# EAGLE design schem (EAGLE 8.7.1)
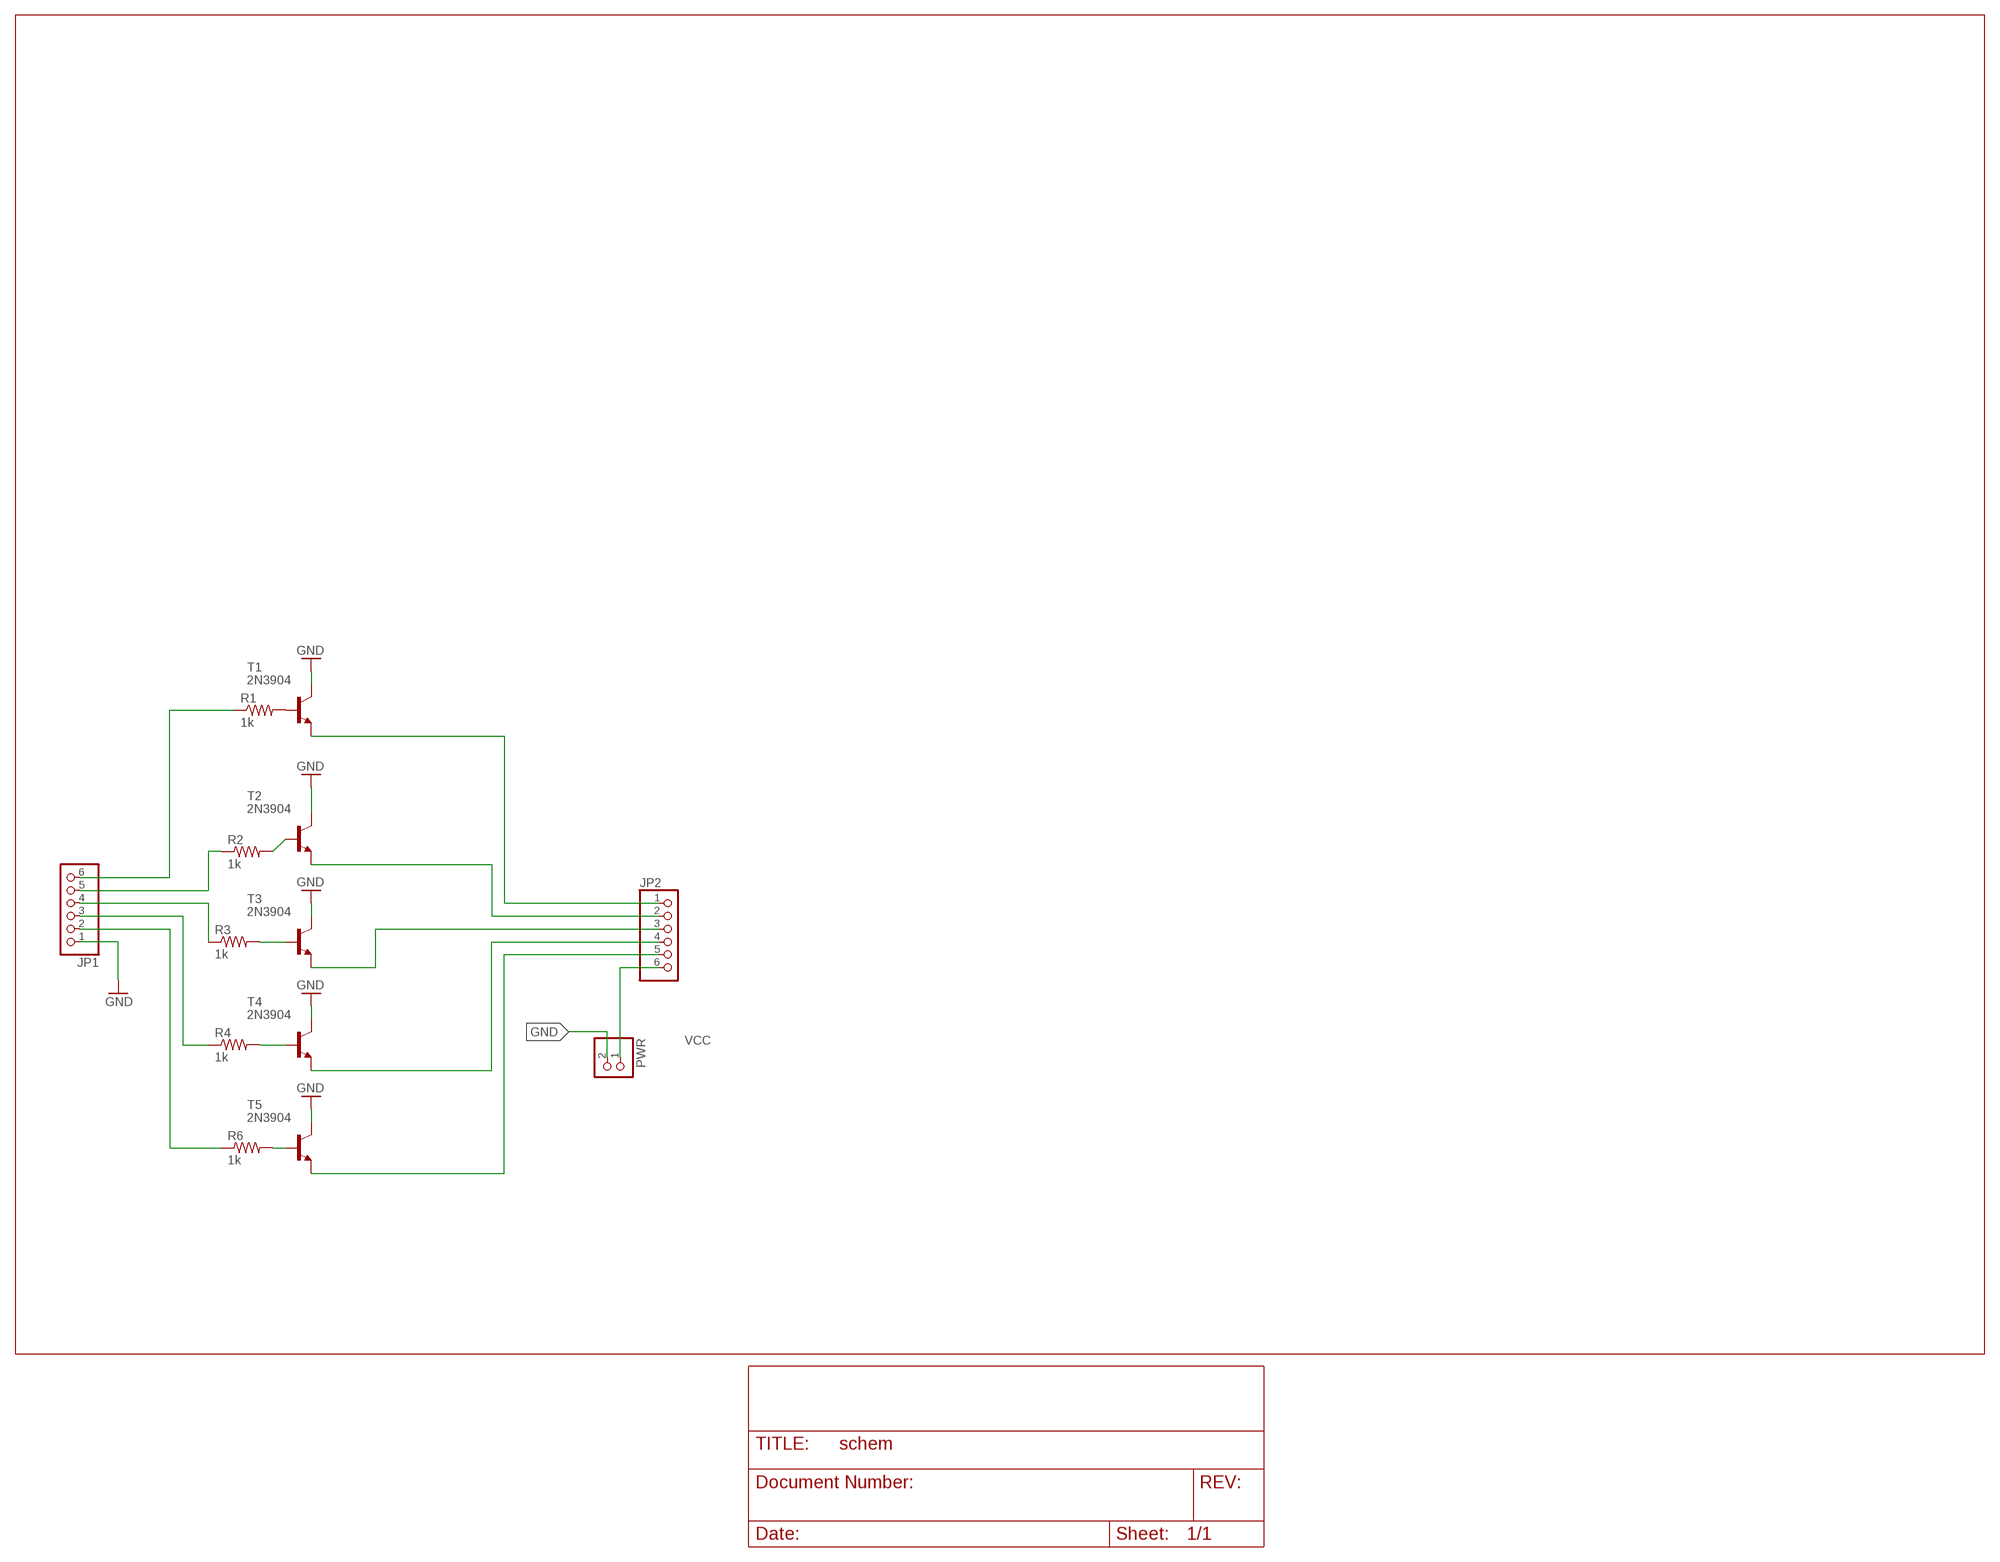
[diagram p0: schematic, sheet 1]

## Parts
JP1  PINHD-1X6  [1X06]
JP2  PINHD-1X6  [1X06]
PWR  PINHD-1X2  [1X02]
R1  1k  R-US_0207/5V  [0207/5V]
R2  1k  R-US_0207/5V  [0207/5V]
R3  1k  R-US_0207/5V  [0207/5V]
R4  1k  R-US_0207/5V  [0207/5V]
R6  1k  R-US_0207/5V  [0207/5V]
T1  2N3904  [TO92]
T2  2N3904  [TO92]
T3  2N3904  [TO92]
T4  2N3904  [TO92]
T5  2N3904  [TO92]

## Nets
GND: JP1.1 PWR.2 T1.1(C) T2.1(C) T3.1(C) T4.1(C) T5.1(C)
N$1: JP1.6 R1.1
N$2: R1.2 T1.2(B)
N$3: JP1.2 R6.1
N$4: R3.2 T3.2(B)
N$5: JP1.5 R2.1
N$6: R2.2 T2.2(B)
N$7: JP2.1 T1.3(E)
N$8: JP1.4 R3.1
N$9: JP1.3 R4.1
N$10: R4.2 T4.2(B)
N$11: JP2.2 T2.3(E)
N$12: R6.2 T5.2(B)
N$13: JP2.3 T3.3(E)
N$14: JP2.4 T4.3(E)
N$15: JP2.5 T5.3(E)
VCC: JP2.6 PWR.1

## Library data of the parts
JP1 = pinhead:PINHD-1X6: PIN HEADER
JP2 = pinhead:PINHD-1X6: PIN HEADER; SPICEPREFIX: X
PWR = pinhead:PINHD-1X2: PIN HEADER
R1-R4 R6 = resistor:R-US_: RESISTOR, American symbol
T1-T5 = transistor:2N3904: NPN TRANSISTOR

## Board
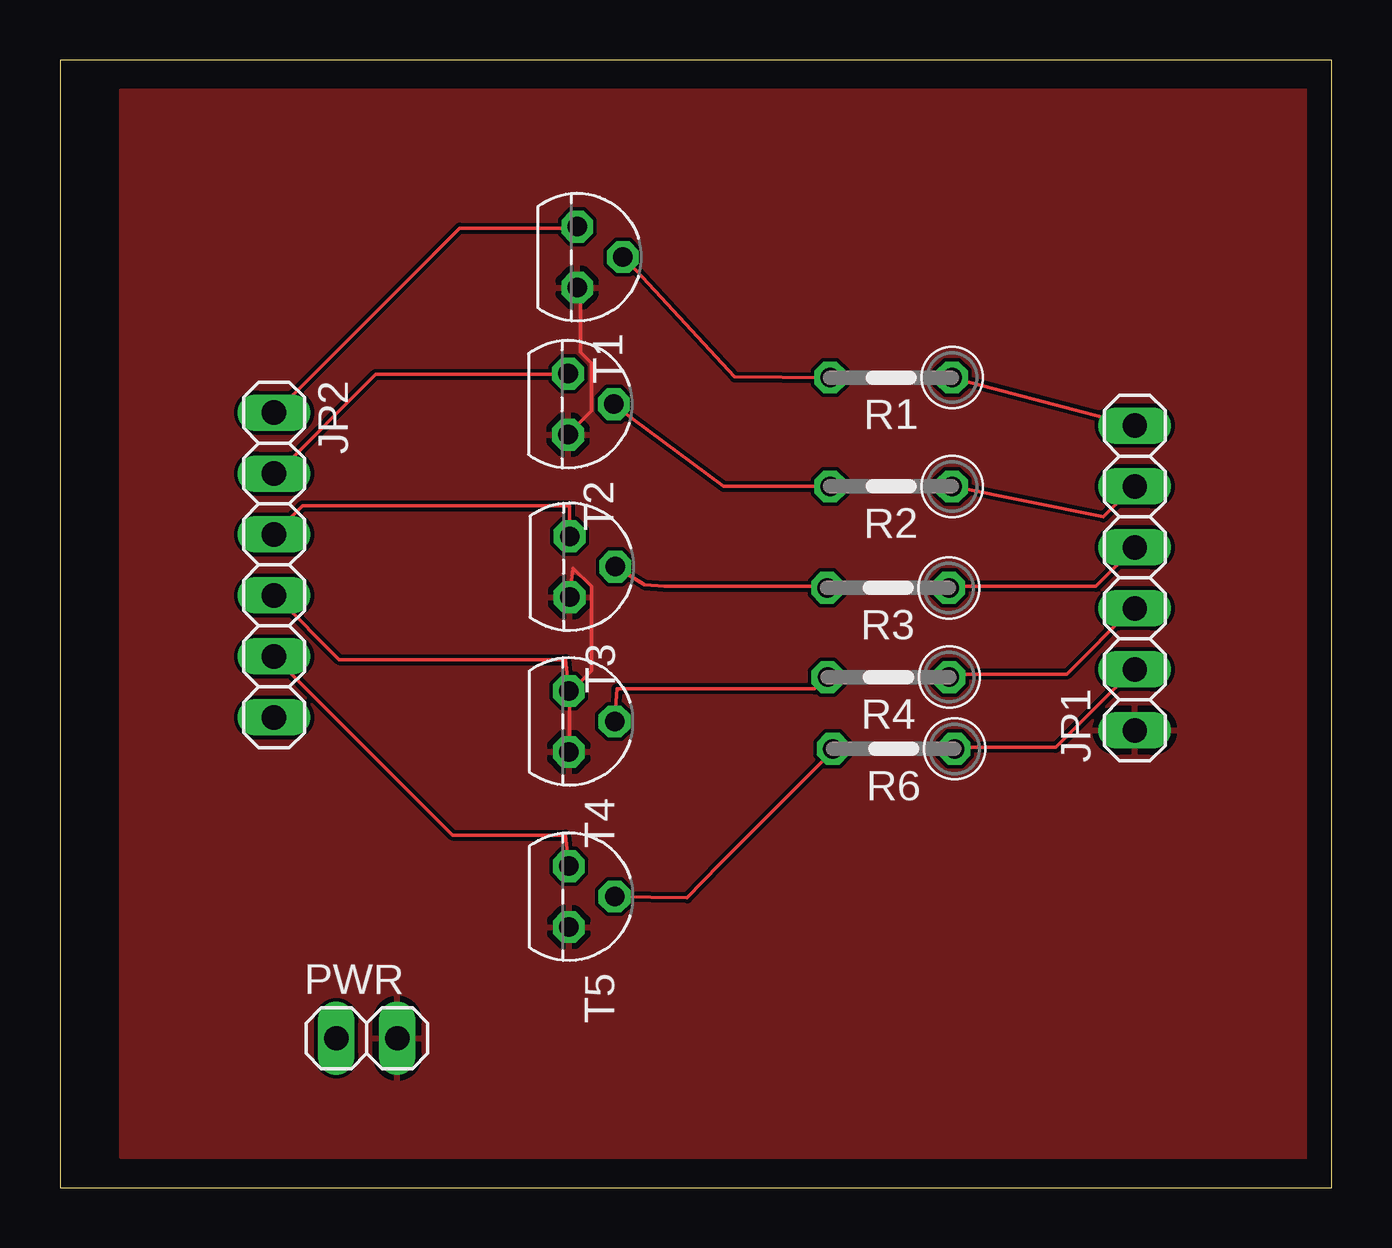
[diagram p1: board, top side]
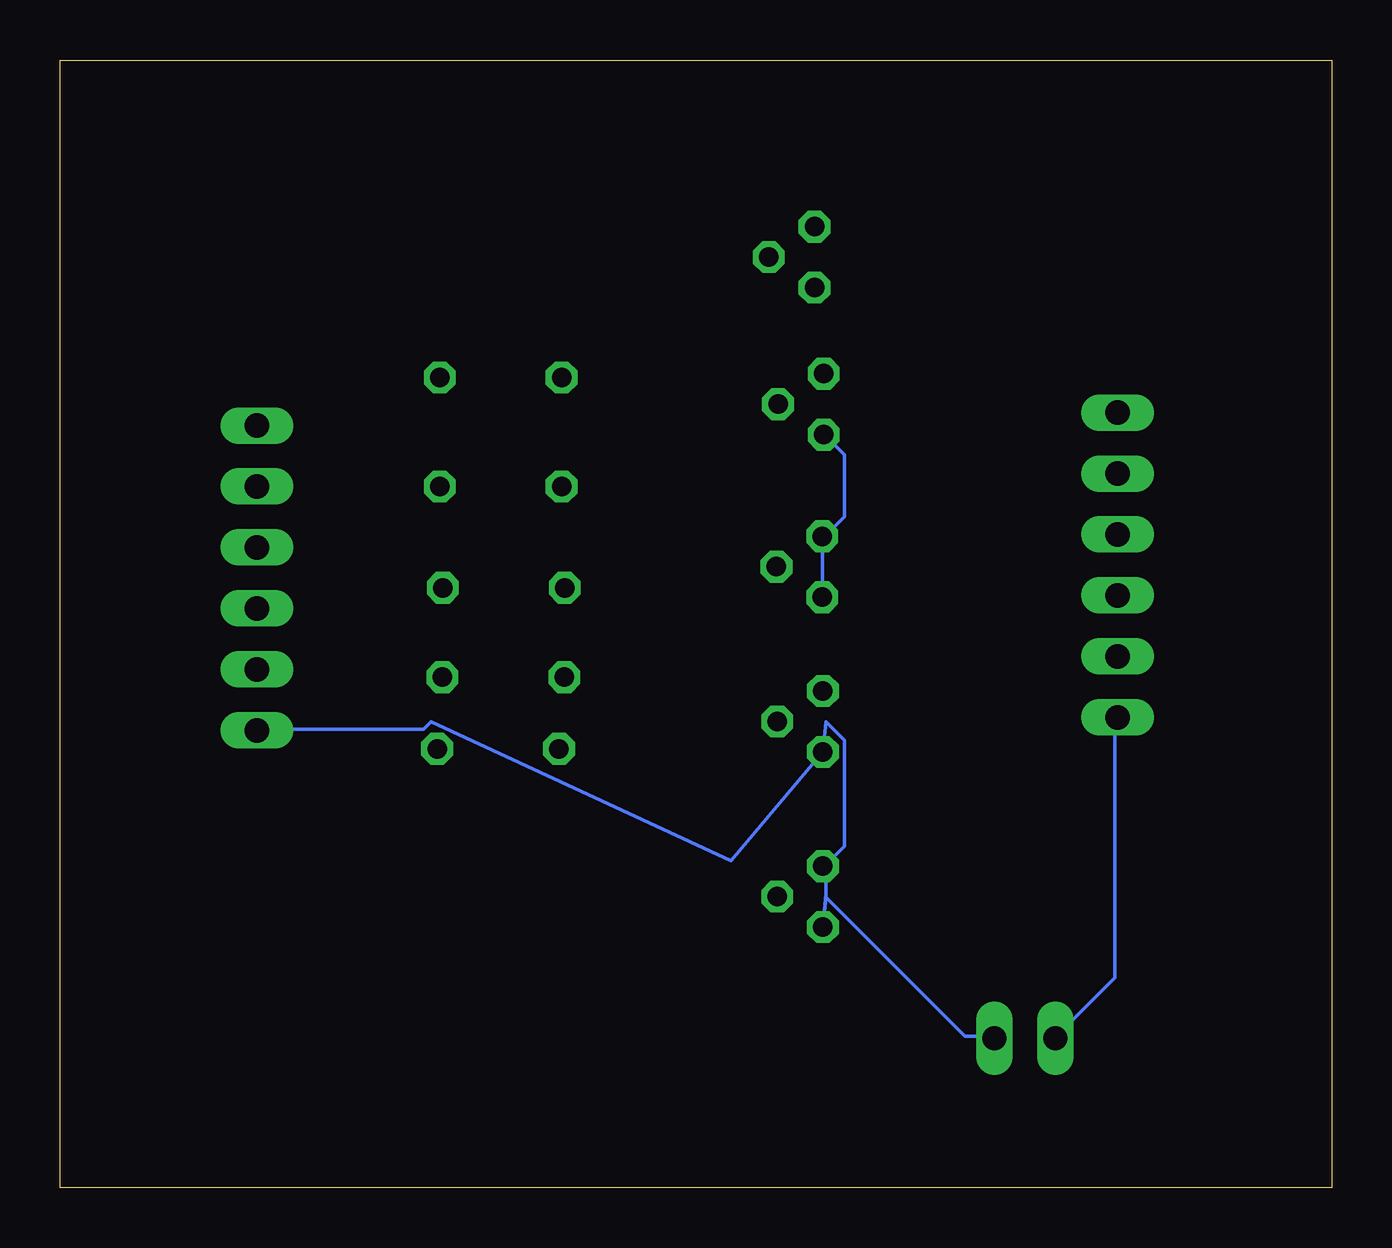
[diagram p2: board, bottom side, seen from below]

Size 53.01 x 46.98 mm. Coordinates in mm from the lower left corner, seen from the top.
Outline: 0,0 53.01,0 53.01,46.98 0,46.98 0,0
Copper layers (1*16): Top 0.035mm / dielectric 1.5mm / Bottom 0.035mm
Design rules "default": minimum track width 6mil, minimum drill 0.35mm, track to track 6mil, track to pad 6mil, pad to pad 6mil, via to via 6mil, smd to smd 6mil, copper to edge 40mil, drill to drill 6mil, minimum pad ring 10mil, minimum via ring 8mil, stop-mask expansion 4mil, vias tented up to drill 0mil, thermal gap 10mil

### Footprints (pad centres in the part's own frame; a part is rotated, then mirrored left to right if it is on the bottom)
1X06 = drill 1.016 long: 1 -6.35,0; 2 -3.81,0; 3 -1.27,0; 4 1.27,0; 5 3.81,0; 6 6.35,0
1X02 = drill 1.016 long: 1 -1.27,0; 2 1.27,0
0207/5V = drill 0.813 octagon: 1 -2.54,0; 2 2.54,0
TO92 = drill 0.813 octagon: 1 1.27,0; 2 0,1.905; 3 -1.27,0

### Placement (x,y rotation side)
JP1  44.8,25.4 90 top
JP2  8.92,25.94 270 top
PWR  12.79,6.22 0 top
R1  34.64,33.75 180 top
R2  34.64,29.21 180 top
R3  34.51,24.99 180 top
R4  34.53,21.26 180 top
R6  34.75,18.28 180 top
T1  21.56,38.77 270 top
T2  21.18,32.64 270 top
T3  21.24,25.87 270 top
T4  21.21,19.42 270 top
T5  21.21,12.12 270 top

### Tracks (layer width: path | path; a pad name or v marks a point on that pad's centre or on a via)
GND
  Top 0.152: T1.1 21.69,37.39 21.69,34.8 22.15,34.34 22.15,32.36 21.23,31.45 T2.1 | T4.1 21.23,19.56 21.23,20.62 22.15,21.54 22.15,25.04 21.39,25.81 T3.1
  Bottom 0.152: T3.1 21.23,25.96 21.23,27.03 20.32,27.94 20.32,30.53 21.08,31.29 T2.1 | PWR.2 14.07,6.3 15.29,6.3 21.08,12.09 T5.1 21.08,12.24 21.08,13.46 20.32,14.22 20.32,18.64 21.08,19.41 T4.1 25.04,13.61 37.54,19.41 37.85,19.1 44.7,19.1 JP1.1
  pour Top: 2.54,45.72 2.54,1.27 52.07,1.27 52.07,45.72
N$1
  Top 0.152: JP1.6 R1.1
N$2
  Top 0.152: R1.2 28.12,33.78 23.52,38.76 T1.2
N$3
  Top 0.152: R6.1 37.39,18.34 41.5,18.34 44.7,21.54 JP1.2
N$4
  Top 0.152: R3.2 31.9,25.04 25.2,25.04 24.36,25.12 T3.2
N$5
  Top 0.152: R2.1 43.48,27.94 44.7,29.16 JP1.5
N$6
  Top 0.152: R2.2 27.66,29.21 23.22,32.51 T2.2
N$7
  Top 0.152: T1.3 21.54,39.98 16.66,39.98 9.04,32.36 JP2.1
N$8
  Top 0.152: R3.1 37.08,25.04 43.18,25.04 44.7,26.57 JP1.4
N$9
  Top 0.152: R4.1 37.08,21.39 41.96,21.39 44.7,24.13 JP1.3
N$10
  Top 0.152: T4.2 23.22,20.78 31.45,20.78 31.9,21.23 R4.2
N$11
  Top 0.152: T2.3 21.08,33.88 13.16,33.88 9.04,29.77 JP2.2
N$12
  Top 0.152: T5.2 26.14,12.06 27.48,13.46 32.21,18.19 R6.2
N$13
  Top 0.152: T3.3 21.23,28.4 10.11,28.4 9.04,27.33 JP2.3
N$14
  Top 0.152: T4.3 21.08,22 11.63,22 9.04,24.59 JP2.4
N$15
  Top 0.152: T5.3 21.08,14.68 16.36,14.68 9.04,22 JP2.5
VCC
  Bottom 0.152: JP2.6 9.04,19.56 9.04,8.74 11.48,6.3 PWR.1